# EAGLE design 2x6-keyboard (EAGLE 6.6.0)
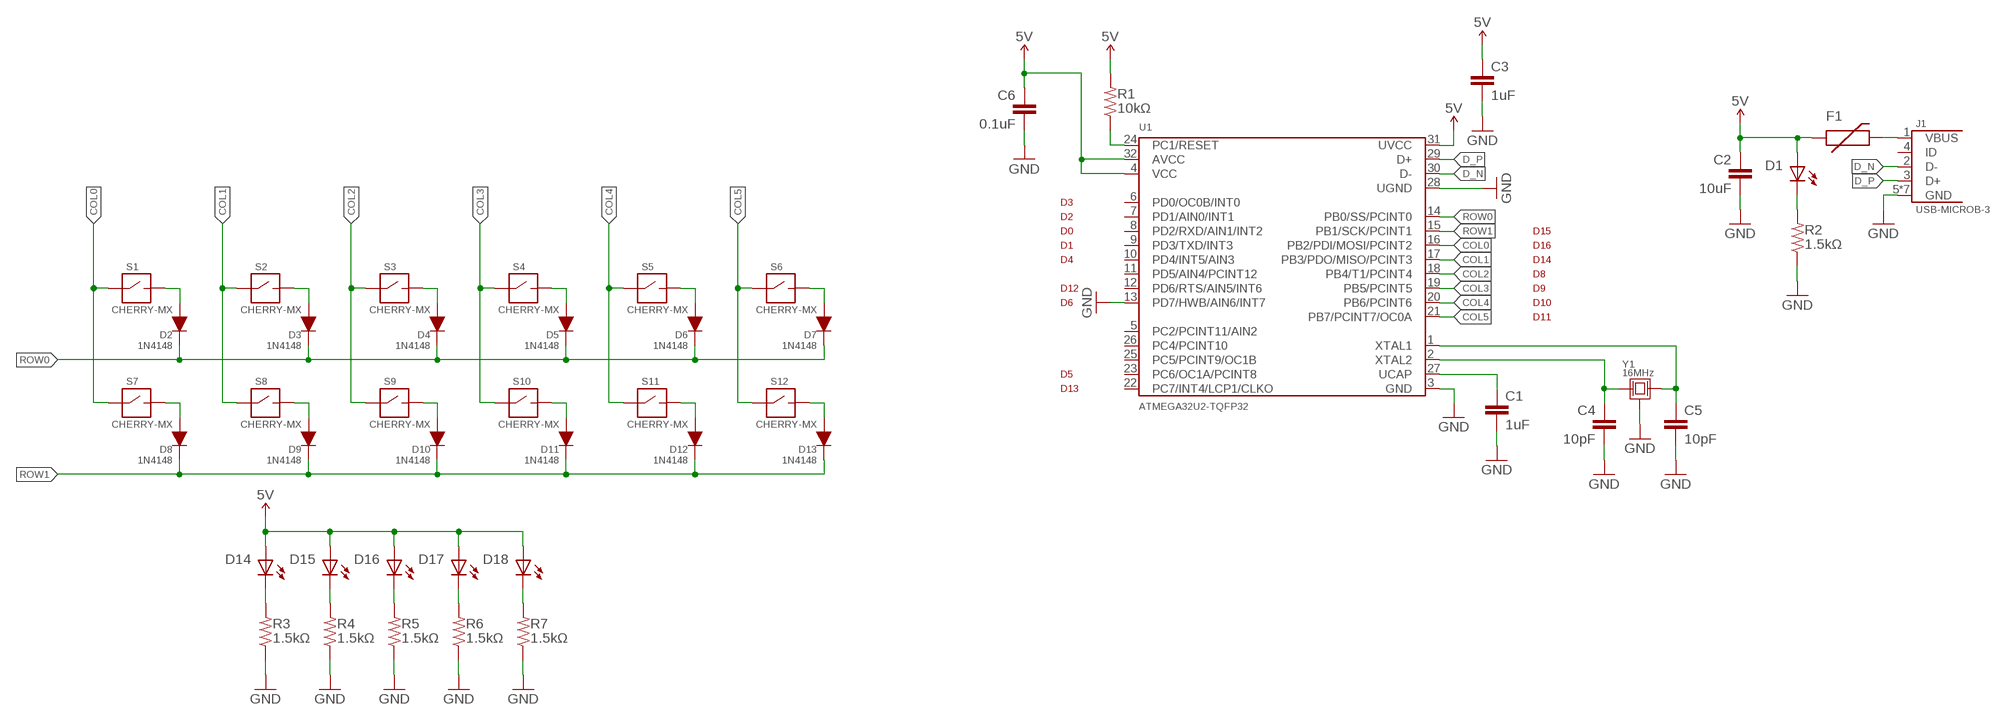
[diagram p0: schematic, sheet 1]

## Parts
C1  1uF  CAP-0603  [0603-CAP]
C2  10uF  CAP-0603  [0603-CAP]
C3  1uF  CAP-0603  [0603-CAP]
C4  10pF  CAP-0603  [0603-CAP]
C5  10pF  CAP-0603  [0603-CAP]
C6  0.1uF  CAP-0603  [0603-CAP]
D1  LED-0603  [0603-LED]
D2  1N4148  DIODE  [SOD-123]
D3  1N4148  DIODE  [SOD-123]
D4  1N4148  DIODE  [SOD-123]
D5  1N4148  DIODE  [SOD-123]
D6  1N4148  DIODE  [SOD-123]
D7  1N4148  DIODE  [SOD-123]
D8  1N4148  DIODE  [SOD-123]
D9  1N4148  DIODE  [SOD-123]
D10  1N4148  DIODE  [SOD-123]
D11  1N4148  DIODE  [SOD-123]
D12  1N4148  DIODE  [SOD-123]
D13  1N4148  DIODE  [SOD-123]
D14  LED-0603  [0603-LED]
D15  LED-0603  [0603-LED]
D16  LED-0603  [0603-LED]
D17  LED-0603  [0603-LED]
D18  LED-0603  [0603-LED]
F1  PTC-1206  [1206-PTC]
J1  USB-MICROB-3  [10118192-0001LF]
R1  10kΩ  RESISTOR-0603  [0603-CAP]
R2  1.5kΩ  RESISTOR-0603  [0603-CAP]
R3  1.5kΩ  RESISTOR-0603  [0603-CAP]
R4  1.5kΩ  RESISTOR-0603  [0603-CAP]
R5  1.5kΩ  RESISTOR-0603  [0603-CAP]
R6  1.5kΩ  RESISTOR-0603  [0603-CAP]
R7  1.5kΩ  RESISTOR-0603  [0603-CAP]
S1  CHERRY-MX  [CHERRY-MX]
S2  CHERRY-MX  [CHERRY-MX]
S3  CHERRY-MX  [CHERRY-MX]
S4  CHERRY-MX  [CHERRY-MX]
S5  CHERRY-MX  [CHERRY-MX]
S6  CHERRY-MX  [CHERRY-MX]
S7  CHERRY-MX  [CHERRY-MX]
S8  CHERRY-MX  [CHERRY-MX]
S9  CHERRY-MX  [CHERRY-MX]
S10  CHERRY-MX  [CHERRY-MX]
S11  CHERRY-MX  [CHERRY-MX]
S12  CHERRY-MX  [CHERRY-MX]
U1  ATMEGA32U2-TQFP32  [TQFP-32]
Y1  16MHz  CRYSTAL-3.2X2.5  [FA-238]

## Nets
5V: C2.1 C3.1 C6.1 D1.A D14.A D15.A D16.A D17.A D18.A F1.P$1 R1.2 U1.4(VCC) U1.31(UVCC) U1.32(AVCC)
COL0: S1.S1 S1.S4(S1) S7.S1 S7.S4(S1) U1.16(PB2/PDI/MOSI/PCINT2)
COL1: S2.S1 S2.S4(S1) S8.S1 S8.S4(S1) U1.17(PB3/PDO/MISO/PCINT3)
COL2: S3.S1 S3.S4(S1) S9.S1 S9.S4(S1) U1.18(PB4/T1/PCINT4)
COL3: S4.S1 S4.S4(S1) S10.S1 S10.S4(S1) U1.19(PB5/PCINT5)
COL4: S5.S1 S5.S4(S1) S11.S1 S11.S4(S1) U1.20(PB6/PCINT6)
COL5: S6.S1 S6.S4(S1) S12.S1 S12.S4(S1) U1.21(PB7/PCINT7/OC0A)
D_N: J1.2(D-) U1.30(D-)
D_P: J1.3(D+) U1.29(D+)
GND: C1.2 C2.2 C3.2 C4.2 C5.2 C6.2 J1.5(GND) J1.P$6(GND) J1.P$7(GND) J1.P$8(GND) J1.P$9(GND) J1.P$10(GND) J1.P$11(GND) R2.1 R3.1 R4.1 R5.1 R6.1 R7.1 U1.3(GND) U1.13(PD7/HWB/AIN6/INT7) U1.28(UGND) Y1.2(GND) Y1.4(GND)
N$1: C1.1 U1.27(UCAP)
N$2: D14.C R3.2
N$3: R1.1 U1.24(PC1/RESET)
N$4: F1.P$2 J1.1(VBUS)
N$5: D1.C R2.2
N$6: C5.1 U1.1(XTAL1) Y1.3
N$7: C4.1 U1.2(XTAL2) Y1.1
N$8: D7.2(A) S6.S2 S6.S3(S2)
N$9: D6.2(A) S5.S2 S5.S3(S2)
N$10: D5.2(A) S4.S2 S4.S3(S2)
N$11: D4.2(A) S3.S2 S3.S3(S2)
N$12: D3.2(A) S2.S2 S2.S3(S2)
N$13: D2.2(A) S1.S2 S1.S3(S2)
N$14: D15.C R4.2
N$15: D8.2(A) S7.S2 S7.S3(S2)
N$16: D9.2(A) S8.S2 S8.S3(S2)
N$17: D10.2(A) S9.S2 S9.S3(S2)
N$18: D11.2(A) S10.S2 S10.S3(S2)
N$19: D12.2(A) S11.S2 S11.S3(S2)
N$20: D13.2(A) S12.S2 S12.S3(S2)
N$21: D16.C R5.2
N$22: D17.C R6.2
N$23: D18.C R7.2
ROW0: D2.1(C) D3.1(C) D4.1(C) D5.1(C) D6.1(C) D7.1(C) U1.14(PB0/SS/PCINT0)
ROW1: D8.1(C) D9.1(C) D10.1(C) D11.1(C) D12.1(C) D13.1(C) U1.15(PB1/SCK/PCINT1)
Unconnected: J1.4(ID) U1.5(PC2/PCINT11/AIN2) U1.6(PD0/OC0B/INT0) U1.7(PD1/AIN0/INT1) U1.8(PD2/RXD/AIN1/INT2) U1.9(PD3/TXD/INT3) U1.10(PD4/INT5/AIN3) U1.11(PD5/AIN4/PCINT12) U1.12(PD6/RTS/AIN5/INT6) U1.22(PC7/INT4/LCP1/CLKO) U1.23(PC6/OC1A/PCINT8) U1.25(PC5/PCINT9/OC1B) U1.26(PC4/PCINT10)

## Notes on the sheet
- D3
- D2
- D0 | D15
- D1 | D16
- D4 | D14
- D8
- D12 | D9
- D6 | D10
- D11
- D5
- D13

## Library data of the parts
C1-C6 = Passives:CAP
D1 D14-D18 = Passives:LED
D2-D13 = Passives:DIODE
F1 = Passives:PTC
J1 = Connectors:USB-MICROB
R1-R7 = Passives:RESISTOR
S1-S12 = Cherry-MX:CHERRY-MX
U1 = Atmel:ATMEGA32U2
Y1 = Passives:CRYSTAL

## Board
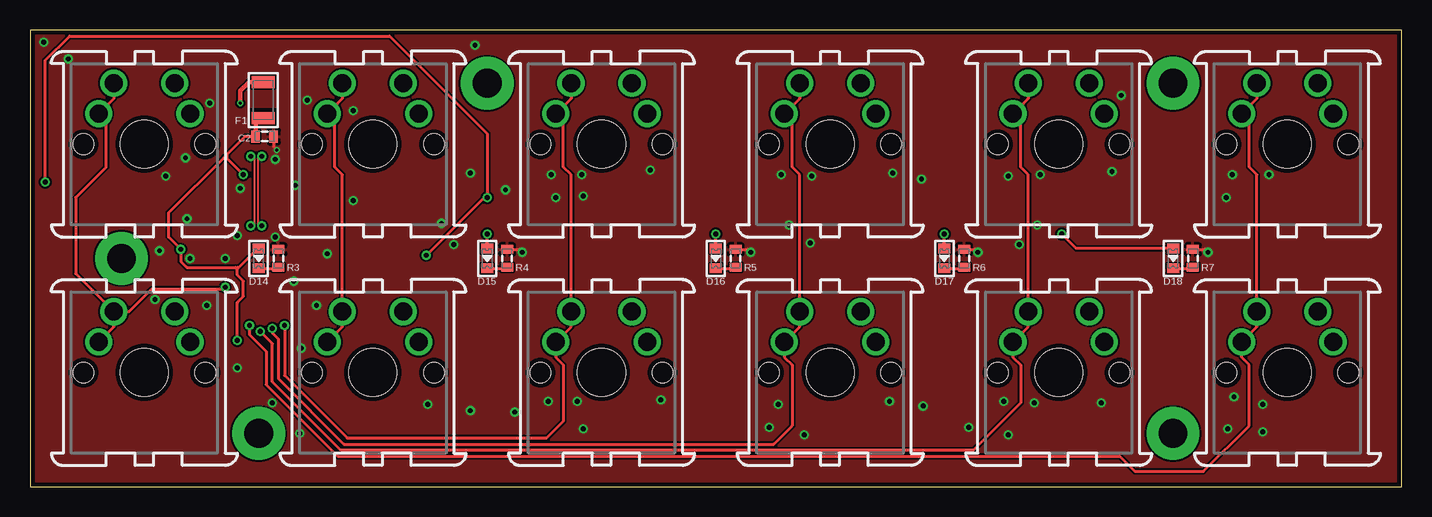
[diagram p1: board, top side]
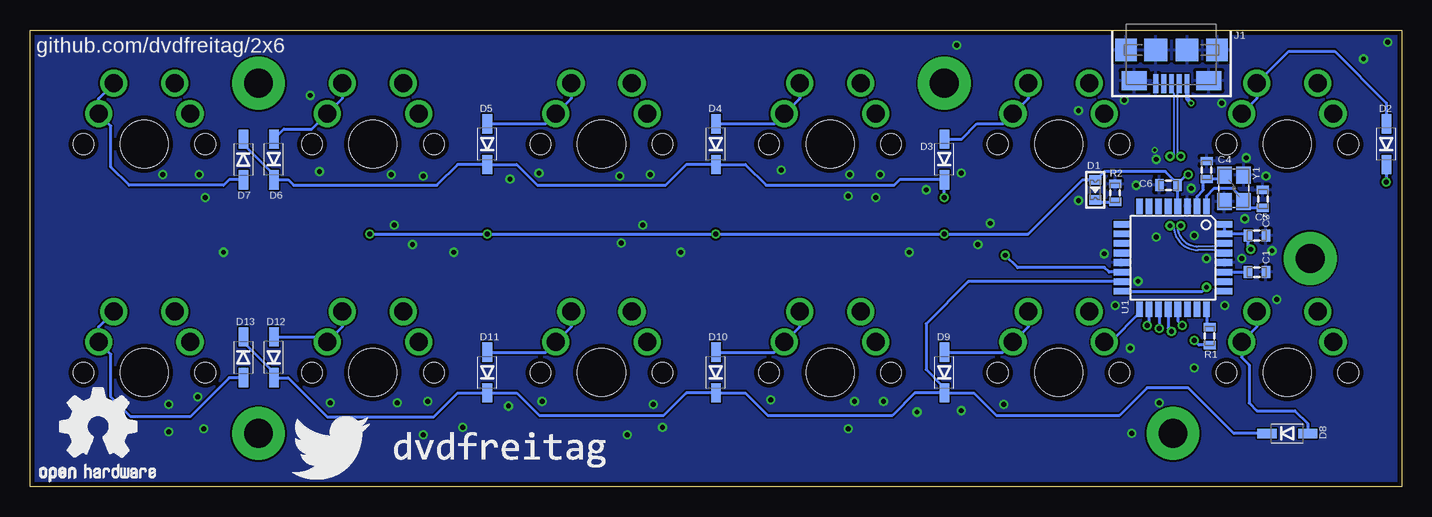
[diagram p2: board, bottom side, seen from below]

Size 114.3 x 38.1 mm. Coordinates in mm from the lower left corner, seen from the top.
Outline: 0,0 114.3,0 114.3,38.1 0,38.1 0,0
Copper layers (1*16): Top 0.035559375mm / dielectric 1.6mm / Bottom 0.035559375mm
Design rules "default *": minimum track width 6mil, minimum drill 10mil, track to track 6mil, track to pad 6mil, pad to pad 6mil, via to via 6mil, smd to smd 6mil, copper to edge 15mil, drill to drill 6mil, minimum pad ring 5mil, minimum via ring 5mil, stop-mask expansion 2.5mil, vias tented up to drill 20mil, thermal gap 10mil

### Footprints (pad centres in the part's own frame; a part is rotated, then mirrored left to right if it is on the bottom)
0603-CAP = smd 0.7 x 1: 1 -0.75,0; 2 0.75,0
0603-LED = smd 0.8 x 1: A 0.825,0; C -0.825,0
SOD-123 = smd 1.6 x 0.8: 1 -1.7,0; 2 1.7,0
1206-PTC = smd 1 x 1.9: P$1 1.5,0; P$2 -1.5,0
10118192-0001LF = smd 1.6 x 0.4: 1 -0.1,1.3; 2 -0.1,0.65; 3 -0.1,0; 4 -0.1,-0.65; 5 -0.1,-1.3 | smd 1.6 x 2.1: P$6 -0.35,-3.1; P$7 -0.35,3.1 | smd 1.9 x 1.9: P$8 -2.9,1.3; P$9 -2.9,-1.3 | smd 1.9 x 1.8: P$10 -2.9,3.8; P$11 -2.9,-3.8
CHERRY-MX = drill 1.499 pad 2.261: S1 -3.81,2.54; S2 2.54,5.08; S3 3.81,2.54; S4 -2.54,5.08 | hole 3.988: 0,0 | hole 1.702: -5.08,0; 5.08,0
TQFP-32 = smd 1.27 x 0.559: 1 -4.293,2.8; 2 -4.293,2; 3 -4.293,1.2; 4 -4.293,0.4; 5 -4.293,-0.4; 6 -4.293,-1.2; 7 -4.293,-2; 8 -4.293,-2.8; 17 4.293,-2.8; 18 4.293,-2; 19 4.293,-1.2; 20 4.293,-0.4; 21 4.293,0.4; 22 4.293,1.2; 23 4.293,2; 24 4.293,2.8 | smd 0.559 x 1.27: 9 -2.8,-4.293; 10 -2,-4.293; 11 -1.2,-4.293; 12 -0.4,-4.293; 13 0.4,-4.293; 14 1.2,-4.293; 15 2,-4.293; 16 2.8,-4.293; 25 2.8,4.293; 26 2,4.293; 27 1.2,4.293; 28 0.4,4.293; 29 -0.4,4.293; 30 -1.2,4.293; 31 -2,4.293; 32 -2.8,4.293
FA-238 = smd 1.4 x 1.2: 1 -1.1,-0.8; 2 1.1,-0.8; 3 1.1,0.8; 4 -1.1,0.8

### Placement (x,y rotation side)
C1  12.06,17.91 0 bottom
C2  19.56,29.21 0 top
C3  12.06,20.95 0 bottom
C4  16.26,26.42 90 bottom
C5  11.56,24 90 bottom
C6  19.43,25.15 180 bottom
D1  25.53,24.77 90 bottom
D2  1.27,28.57 90 bottom
D3  38.1,27.3 90 bottom
D4  57.15,28.57 90 bottom
D5  76.2,28.57 90 bottom
D6  93.98,27.3 90 bottom
D7  96.52,27.3 270 bottom
D8  9.53,4.45 0 bottom
D9  38.1,9.53 90 bottom
D10  57.15,9.53 90 bottom
D11  76.2,9.53 90 bottom
D12  93.98,10.79 90 bottom
D13  96.52,10.79 270 bottom
D14  19.05,19.05 90 top
D15  38.1,19.05 90 top
D16  57.15,19.05 90 top
D17  76.2,19.05 90 top
D18  95.25,19.05 90 top
F1  19.43,32.26 270 top
J1  19.18,33.53 270 bottom
R1  16,12.57 270 bottom
R2  23.88,24.51 270 bottom
R3  20.7,19.05 270 top
R4  39.75,19.05 270 top
R5  58.8,19.05 270 top
R6  77.85,19.05 270 top
R7  96.9,19.05 270 top
S1  9.53,28.57 0 top
S2  28.57,28.57 0 top
S3  47.62,28.57 0 top
S4  66.67,28.57 0 top
S5  85.72,28.57 0 top
S6  104.78,28.57 0 top
S7  9.53,9.53 0 top
S8  28.57,9.53 0 top
S9  47.62,9.53 0 top
S10  66.67,9.53 0 top
S11  85.72,9.53 0 top
S12  104.78,9.53 0 top
U1  19.05,19.1 270 bottom
U$1  [OSHW]  113.54,0.25 0 bottom
U$2  [TWITTER]  92.46,0 0 bottom
Y1  13.97,24.89 270 bottom

### Tracks (layer width: path | path; a pad name or v marks a point on that pad's centre or on a via)
5V  (via drill 0.41 pad 0.76)
  Top 0.254: D18.A 87.19,19.88 v85.98,21.08 | D17.A v76.2,21.08 | D16.A v57.15,21.08 | D15.A v38.1,21.08 | 16.13,27.43 11.56,22.86 11.56,20.83 v12.57,19.81 12.57,18.8 13.08,18.29 17.14,18.29 | 16.13,27.43 16.26,27.56 | 16.26,27.56 16.38,27.69 | 16.38,27.69 17.91,29.21 C2.1 | v17.78,26.04 16.38,27.43 | 16.38,27.43 16.26,27.56 | 16.38,27.69 16.38,27.43 | 16.38,27.43 16.13,27.43 | 17.14,18.29 17.27,18.29 | 17.27,18.29 17.4,18.29 | 17.4,18.29 18.99,19.88 D14.A | v17.27,12.19 17.27,15.37 17.78,15.88 17.78,17.14 17.27,17.65 17.27,18.16 | 17.27,18.16 17.27,18.29 | 17.4,18.29 17.27,18.16 | 17.27,18.16 17.14,18.29
  Top 0.381: C2.1 18.81,30.76 F1.P$1
  Bottom 0.254: U1.4 18.65,25.15 C6.1 | U1.32 U1.31 12.96,21.1 C3.1 12.81,20.05 v12.57,19.81 | R1.2 16.9,11.82 v17.27,12.19 | v85.98,21.08 v76.2,21.08 v57.15,21.08 v38.1,21.08 31.11,21.08 26.61,25.59 D1.A 25.46,25.59 24.77,26.29 19.68,26.29 18.68,25.29 C6.1 | v17.78,26.04 17.91,26.04 18.68,25.26 C6.1
COL0  (via drill 0.41 pad 0.76)
  Top 0.254: S1.S4 6.99,32.38 S1.S1 6.35,30.48 6.35,26.67 3.81,24.13 3.81,17.78 S7.S4 | S7.S1 6.99,13.34 S7.S4 | S7.S4 8.26,14.61 10.16,16.51 16.13,16.51 v16.26,16.64
  Bottom 0.254: U1.16 16.59,16.3 v16.26,16.64
COL1
  Top 0.254: S2.S4 26.04,32.38 S2.S1 25.4,30.48 25.4,26.67 26.04,26.04 S8.S4 26.04,13.34 S8.S1
  Bottom 0.254: U1.17 21.84,14.48 24.26,12.06 S8.S1
COL2  (via drill 0.41 pad 0.76)
  Top 0.254: S3.S4 45.09,32.38 S3.S1 44.45,30.48 44.45,26.67 45.09,26.04 S9.S4 45.09,13.34 S9.S1 43.81,10.79 44.45,10.16 44.45,5.46 43.05,4.06 26.42,4.06 21.21,9.27 21.21,13.08 v21.21,13.46
  Bottom 0.254: U1.18 21.08,14.78 21.08,13.59 v21.21,13.46
COL3  (via drill 0.41 pad 0.76)
  Top 0.254: S4.S4 64.14,32.38 S4.S1 63.5,30.48 63.5,26.67 64.14,26.04 S10.S4 64.14,13.34 S10.S1 62.87,10.79 63.5,10.16 63.5,5.08 61.98,3.56 26.16,3.56 20.7,9.02 20.7,12.32 20.19,12.83 v20.19,13.21
  Bottom 0.254: U1.19 20.19,14.75 v20.19,13.21
COL4  (via drill 0.41 pad 0.76)
  Top 0.254: S5.S4 83.19,32.38 S5.S1 82.55,30.48 82.55,26.67 83.19,26.04 S11.S4 83.19,13.34 S11.S1 81.92,10.79 82.55,10.16 82.55,6.99 78.61,3.05 25.91,3.05 20.19,8.76 20.19,11.94 v19.18,12.95
  Bottom 0.254: U1.20 19.45,13.23 v19.18,12.95
COL5  (via drill 0.41 pad 0.76)
  Top 0.254: S6.S4 102.23,32.38 S6.S1 101.6,30.48 101.6,26.67 102.23,26.04 S12.S4 102.23,13.34 S12.S1 100.97,10.79 101.6,10.16 101.6,5.08 97.79,1.27 92.08,1.27 90.81,2.54 25.65,2.54 19.68,8.51 19.68,11.3 18.29,12.7 v18.29,13.46
  Bottom 0.254: U1.21 18.65,13.82 v18.29,13.46
D_N  (via drill 0.41 pad 0.76)
  Top 0.152: v18.39,27.56 18.69,27.56 18.69,21.77 v18.39,21.77
  Bottom 0.152: J1.2 18.53,33.01 18.69,32.84 18.69,27.56 v18.39,27.56 | v18.39,21.77 18.69,21.77 arc-90 16.97,20.04 15.39,20.04 15.13,20.3 U1.30
D_P  (via drill 0.41 pad 0.76)
  Top 0.152: v19.3,27.56 19,27.56 19,21.77 v19.3,21.77
  Bottom 0.152: J1.3 19.18,33.02 19,32.84 19,27.56 v19.3,27.56 | v19.3,21.77 19,21.77 arc-90 16.97,19.74 15.39,19.74 15.16,19.5 U1.29
GND  (via drill 0.25, 0.41 pad 0.76)
  Top 0.254: C2.2 20.31,28.33 v20.57,28.07 | R4.1 40.78,19.8 v41.02,19.56 | R5.1 59.83,19.8 v60.07,19.56 | R6.1 78.75,19.8 v78.99,19.56 | R7.1 97.93,19.8 v98.17,19.56
  other vias: 20.45,20.83 22.1,25.15 20.45,27.3 17.53,24.89 13.08,22.35 13.34,19.05 16.26,19.05 17.27,20.95 14.73,15.11 23.88,15.11 21.97,17.14 24.77,19.43 26.92,23.88 10.79,19.68 10.41,15.62 11.3,25.91 12.95,27.43 3.17,35.69 1.14,37.08 26.92,31.37 23.11,32.26 14.99,32 22.61,11.56 22.48,4.45 17.27,9.91 33.15,6.86 36.7,6.35 40.39,6.22 43.18,7.11 46.1,4.83 45.59,7.11 52.58,7.24 62.36,6.86 61.59,4.95 64.52,4.32 71.63,7.11 74.42,6.73 78.23,4.95 81.15,7.11 81.53,4.32 83.69,6.99 89.28,6.99 99.82,4.83 100.33,7.49 102.74,6.86 102.74,4.57 103.25,26.04 100.2,26.04 99.69,24.13 90.17,26.29 90.93,32.64 81.53,25.91 84.2,26.04 74.3,25.65 71.88,26.16 65.15,25.91 62.61,26.04 51.69,26.42 46.1,24.26 45.97,26.04 43.43,26.04 43.81,24.13 39.62,24.77 36.7,26.16 35.31,20.19 34.29,21.97 65.02,20.32 63.25,21.84 82.42,20.19 83.95,21.84 37.08,36.83 20.19,6.99
  pour Bottom: -2.54,40.64 116.84,40.64 116.84,-2.54 -2.54,-2.54
  pour Top: -1.27,39.37 115.57,39.37 115.57,-1.27 -1.27,-1.27
N$1
  Bottom 0.254: U1.27 C1.1
N$2
  Top 0.254: D14.C 20.63,18.23 R3.2
N$3
  Bottom 0.254: U1.24 16.25,13.57 R1.1
N$4  (via drill 0.25)
  Top 0.381: v17.53,32 17.53,33.02 18.26,33.76 F1.P$2
  Bottom 0.381: J1.1 17.88,32.35 v17.53,32
N$5
  Bottom 0.254: D1.C 25.53,23.76 R2.2
N$6
  Bottom 0.254: U1.1 16.25,24.26 15.62,24.89 14.1,24.89 13.46,24.26 arc16 Y1.3 12.88,23.25 C5.1
N$7
  Bottom 0.254: Y1.1 15.1,25.67 C4.1 16.51,25.54 16.51,24.77 17.05,24.23 U1.2
N$8
  Bottom 0.254: S6.S2 108.58,32.38 S6.S3 107.57,30.1 107.57,26.67 106.05,25.15 98.17,25.15 97.71,25.61 D7.2
N$9
  Bottom 0.254: S5.S2 88.27,32.38 S5.S3 90.81,29.84 93.14,29.84 D6.2
N$10
  Bottom 0.254: S4.S2 69.22,32.38 S4.S3 71.33,30.27 D5.2
N$11
  Bottom 0.254: S3.S2 50.16,32.38 S3.S3 52.27,30.27 D4.2
N$12
  Bottom 0.254: S2.S2 31.11,32.38 S2.S3 33.23,30.27 35.38,30.27 36.65,29 D3.2
N$13
  Bottom 0.254: S1.S3 12.06,32.38 S1.S2 9.4,36.32 5.59,36.32 1.27,32 D2.2
N$14
  Top 0.254: D15.C 39.68,18.23 R4.2
N$15
  Bottom 0.254: S7.S2 12.06,13.34 S7.S3 13.34,10.79 12.7,10.16 12.7,6.99 12.06,6.35 8.89,6.35 7.83,5.29 D8.2
N$16
  Bottom 0.254: S8.S2 31.11,13.34 S8.S3 33.23,11.22 D9.2
N$17
  Bottom 0.254: S9.S2 50.16,13.34 S9.S3 52.27,11.22 D10.2
N$18
  Bottom 0.254: S10.S2 69.22,13.34 S10.S3 71.33,11.22 D11.2
N$19
  Bottom 0.254: S11.S2 88.27,13.34 S11.S3 89.97,12.49 D12.2
N$20
  Bottom 0.254: S12.S2 108.58,13.34 S12.S3 107.57,11.05 107.57,7.49 105.92,5.84 100.97,5.84 97.71,9.1 D13.2
N$21
  Top 0.254: D16.C 58.73,18.23 R5.2
N$22
  Top 0.254: D17.C 77.78,18.23 R6.2
N$23
  Top 0.254: D18.C 96.83,18.23 R7.2
N$24
  cutout Top: 18.29,31.5 20.57,31.5 20.57,30.1 19.18,30.1 19.18,30.61 18.29,30.61
N$25  (via drill 2.4 pad 4.4)
  other vias: 95.25,33.66
N$26  (via drill 2.4 pad 4.4)
  other vias: 95.25,4.45
N$27  (via drill 2.4 pad 4.4)
  other vias: 19.05,4.45
N$28  (via drill 2.4 pad 4.4)
  other vias: 7.62,19.05
N$29  (via drill 2.4 pad 4.4)
  other vias: 38.1,33.66
ROW0  (via drill 0.41 pad 0.76)
  Top 0.254: v1.27,25.4 1.27,35.56 3.3,37.59 29.97,37.59 38.1,29.46 v38.1,24.13 37.85,24.13 v33.02,19.3
  Bottom 0.254: D7.1 96.52,28.57 93.98,26.04 D6.1 92.79,25.61 92.33,25.15 80.39,25.15 78.66,26.88 D5.1 73.74,26.88 72.01,25.15 61.34,25.15 59.61,26.88 D4.1 54.69,26.88 52.96,25.15 42.29,25.15 41.83,25.61 D3.1 v38.1,24.13 | D2.1 v1.27,25.4 | U1.14 24.38,17.9 24.77,18.29 30.86,18.29 32,18.28 v33.02,19.3
ROW1
  Bottom 0.254: D13.1 96.52,12.06 93.98,9.53 D12.1 92.79,9.1 89.53,5.84 80.64,5.84 78.66,7.83 D11.1 73.74,7.83 71.88,5.97 61.47,5.97 59.61,7.83 D10.1 54.69,7.83 52.83,5.97 42.42,5.97 40.56,7.83 D9.1 | D9.1 35.64,7.83 33.78,5.97 23.5,5.97 21.21,8.26 17.78,8.26 13.97,4.45 D8.1 | U1.15 36.11,17.1 39.62,13.59 39.62,9.78 38.35,8.51 38.35,8.08 D9.1

### Text on the board
bPlace: github.com/dvdfreitag/2x6